# Altium project nRF2460.PrjPCB
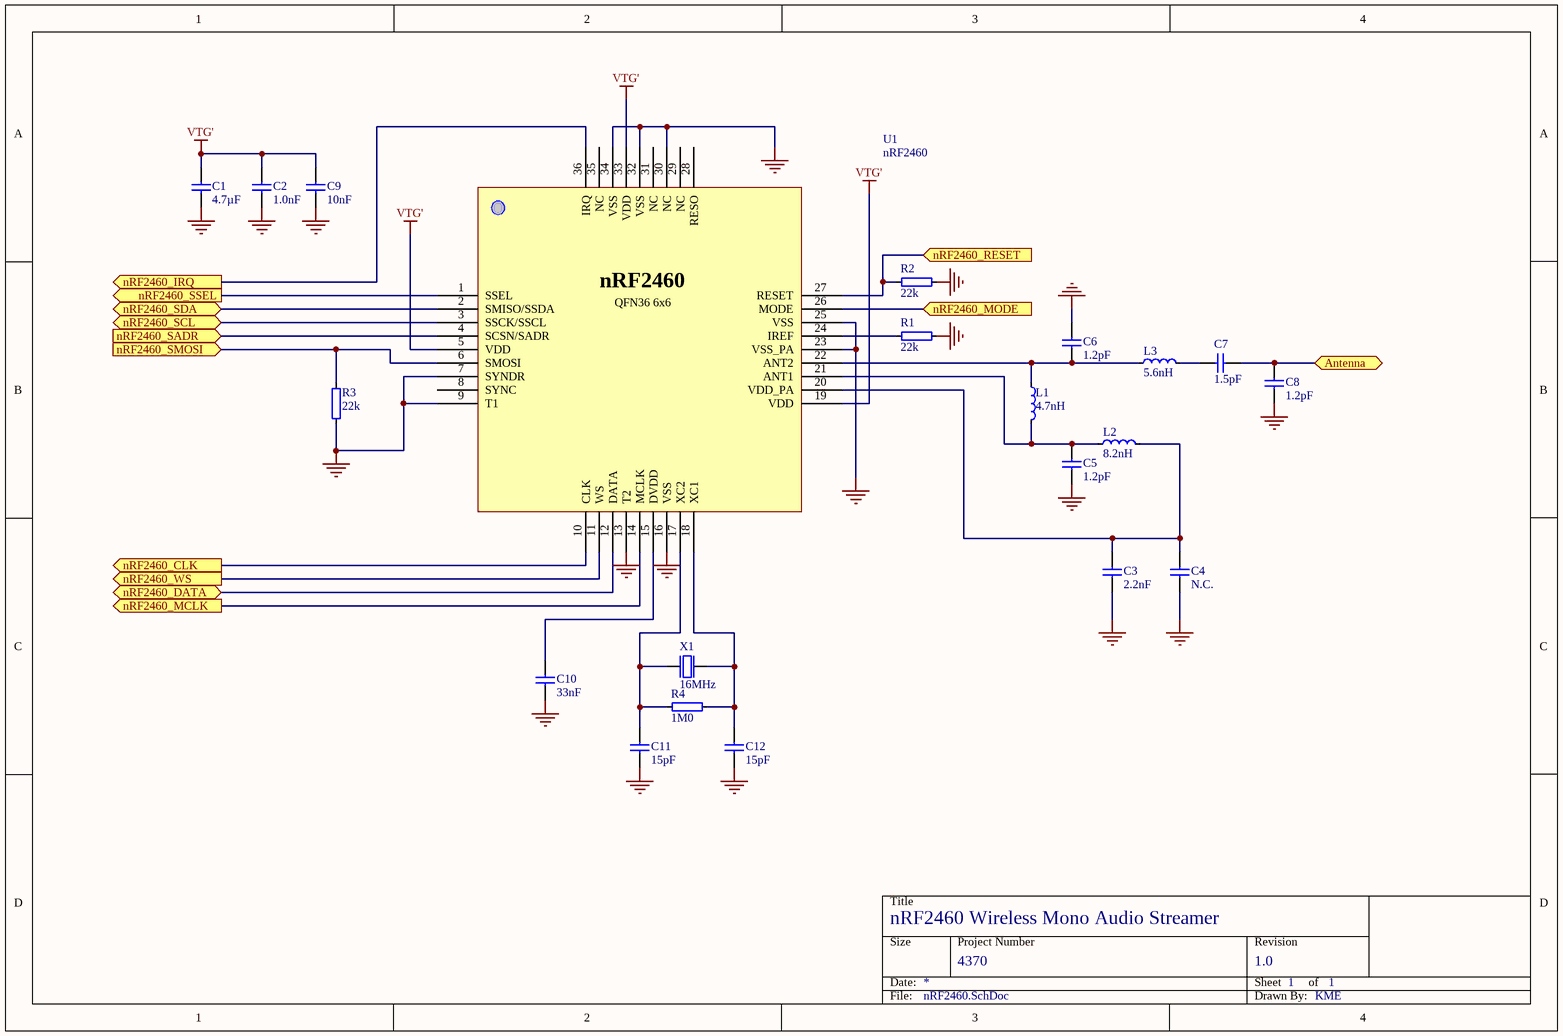
[diagram p0: nRF2460.SchDoc]
1 sheet, 21 parts. Net scope: flat (ports and power ports of the same name join across sheets).
Board file: nRF2460.PcbDoc

## Sheet nRF2460.SchDoc: nRF2460 Wireless Mono Audio Streamer
size A4; Revision: 1.0; SheetNumber: 1; SheetTotal: 1; DrawnBy: KME; ProjectNumber: 4370

### Parts
C1  4.7µF  [0805]
C2  1.0nF  [0402s]
C3  2.2nF  [0402s]
C4  N.C.  [0402s]  (no BOM)
C5  1.2pF  [0402s]
C6  1.2pF  [0402s]
C7  1.5pF  [0402s]
C8  1.2pF  [0402s]
C9  10nF  [0402s]
C10  33nF  [0402s]
C11  15pF  [0402s]
C12  15pF  [0402s]
L1  4.7nH  [0402s]
L2  8.2nH  [0402s]
L3  5.6nH  [0402s]
R1  22k  [0402s]
R2  22k  [0402s]
R3  22k  [0402s]
R4  1M0  [0402s]
U1  nRF2460  [Nordic_QFN36]
X1  16MHz  [BT-XTAL_3225]

### Ports
Antenna (bidir), nRF2460_CLK (out), nRF2460_DATA (bidir), nRF2460_IRQ (out), nRF2460_MCLK (out), nRF2460_MODE (in), nRF2460_RESET (in), nRF2460_SADR (in), nRF2460_SCL (bidir), nRF2460_SDA (bidir), nRF2460_SMOSI (in), nRF2460_SSEL (out), nRF2460_WS (out)

### Nets
GND: C1.2 C2.2 C3.1 C4.1 C5.1 C6.2 C8.1 C9.2 C10.1 C11.1 C12.1 R1.1 R2.2 R3.2 U1.7(SYNDR) U1.9(T1) U1.13(T2) U1.16(VSS) U1.23(VSS_PA) U1.25(VSS) U1.30(NC) U1.32(VSS) U1.34(VSS) X1.2(GND) X1.4(GND)
VTG': C1.1 C2.1 C9.1 U1.5(VDD) U1.19(VDD) U1.33(VDD)
NetC3_2: C3.2 C4.2 L2.2 U1.20(VDD_PA)
NetC5_2: C5.2 L1.2 L2.1 U1.21(ANT1)
NetC6_1: C6.1 L1.1 L3.1 U1.22(ANT2)
NetC7_1: C7.1 C8.2 ; port Antenna
NetC7_2: C7.2 L3.2
NetC10_2: C10.2 U1.15(DVDD)
NetC11_2: C11.2 R4.2 U1.17(XC2) X1.1(inp)
NetC12_2: C12.2 R4.1 U1.18(XC1) X1.3(out)
NetR1_2: R1.2 U1.24(IREF)
NetR2_1: R2.1 U1.27(RESET) ; port nRF2460_RESET
NetR3_1: R3.1 U1.6(SMOSI) ; port nRF2460_SMOSI
NetU1_1: U1.1(SSEL) ; port nRF2460_SSEL
NetU1_2: U1.2(SMISO/SSDA) ; port nRF2460_SDA
NetU1_3: U1.3(SSCK/SSCL) ; port nRF2460_SCL
NetU1_4: U1.4(SCSN/SADR) ; port nRF2460_SADR
NetU1_10: U1.10(CLK) ; port nRF2460_CLK
NetU1_11: U1.11(WS) ; port nRF2460_WS
NetU1_12: U1.12(DATA) ; port nRF2460_DATA
NetU1_14: U1.14(MCLK) ; port nRF2460_MCLK
NetU1_26: U1.26(MODE) ; port nRF2460_MODE
NetU1_36: U1.36(IRQ) ; port nRF2460_IRQ

Not connected (* = marked no-connect by the designer): U1 8(SYNC) 28(RESO) 29(NC) 31(NC) 35(NC)

### Notes on the sheet
- Title
- Size
- Date:
- Project Number
- Sheet         of
- Revision
- File:
- Drawn By:
- (in symbol nRF2460) QFN36 6x6

### Library data of the parts
C1 = C0805-4µ7: Chip Cap 0805; Note: Chip Cap 10%; Artikkelnr Noca: 20039266; Published: 2009-08-21; LatestRevisionDate: 2009-11-23; Publisher: Nordic Semiconductor; Value: 4.7µF; Part Number: C0805-4µ7; Manufacturer: *; Manufacturer Part Number: *; Datasheet: *; Pin Count: 2; Supplier: *; Supplier part number: *; 2nd source Supplier: *; 2nd source part number: *
C2 = C0402-1n0: Chip Cap 0402; Note: Chip Cap 10%; Artikkelnr Noca: 20039223; Published: 2009-05-08; LatestRevisionDate: 2009-11-23; Publisher: Nordic Semiconductor; Value: 1.0nF; Part Number: C0402-1n0; Manufacturer: *; Manufacturer Part Number: *; Datasheet: *; Pin Count: 2; Supplier: *; Supplier part number: *; 2nd source Supplier: *; 2nd source part number: *
C3 = C0402-2n2: Chip Cap 0402; Note: Chip Cap 10%; Artikkelnr Noca: 20039221; Part Number: C0402-2n2; Manufacturer: *; Manufacturer Part Number: *; Datasheet: *; LatestRevisionDate: 2009-11-23; Pin Count: 2; Publisher: Nordic Semiconductor; Published: 2009-05-08; Value: 2.2nF; Supplier: *; Supplier part number: *; 2nd source Supplier: *; 2nd source part number: *
C4 = C0402-N.C.: Chip Cap 0402; Artikkelnr Noca: N.A.; Part Number: C0402-N.C.; Manufacturer: *; Manufacturer Part Number: *; Datasheet: *; LatestRevisionDate: 2009-05-08; Pin Count: 2; Publisher: Nordic Semiconductor; Published: 2009-05-08; Value: N.C.; Note: Chip Cap; Supplier: *; Supplier part number: *; 2nd source Supplier: *; 2nd source part number: *
C5 C6 C8 = C0402-1.2p: Chip Cap 0402; Note: Chip Cap 1%; Artikkelnr Noca: N.A.; Part Number: C0402-1.2p; Manufacturer: *; Manufacturer Part Number: *; Datasheet: *; LatestRevisionDate: 2009-05-08; Pin Count: 2; Publisher: Nordic Semiconductor; Published: 2009-05-08; Value: 1.2pF; Supplier: *; Supplier part number: *; 2nd source Supplier: *; 2nd source part number: *
C7 = C0402-1.5p: Chip Cap 0402; Note: Chip Cap 1%; Artikkelnr Noca: 20029139; Part Number: C0402-1.5p; Manufacturer: *; Manufacturer Part Number: *; Datasheet: *; LatestRevisionDate: 2009-11-23; Pin Count: 2; Publisher: Nordic Semiconductor; Published: 2009-05-08; Value: 1.5pF; Supplier: *; Supplier part number: *; 2nd source Supplier: *; 2nd source part number: *
C9 = C0402-10n: Chip Cap 0402; Note: Chip Cap 10%; Artikkelnr Noca: 20039166; Published: 2009-05-08; LatestRevisionDate: 2009-11-23; Publisher: Nordic Semiconductor; Value: 10nF; Part Number: C0402-10n; Manufacturer: *; Manufacturer Part Number: *; Datasheet: *; Pin Count: 2; Supplier: *; Supplier part number: *; 2nd source Supplier: *; 2nd source part number: *
C10 = C0402-33n: Chip Cap 0402; Note: Chip Cap 10%; Artikkelnr Noca: 20039222; Published: 2009-05-08; Publisher: Nordic Semiconductor; Value: 33nF; Part Number: C0402-33n; Manufacturer: *; Manufacturer Part Number: *; Datasheet: *; LatestRevisionDate: 2009-11-23; Pin Count: 2; Supplier: *; Supplier part number: *; 2nd source Supplier: *; 2nd source part number: *
C11 C12 = C0402-15p: Chip Cap 0402; Note: Chip Cap 5%; Artikkelnr Noca: 20029141; Published: 2009-05-08; Publisher: Nordic Semiconductor; Value: 15pF; Part Number: C0402-15p; Manufacturer: *; Manufacturer Part Number: *; Datasheet: *; LatestRevisionDate: 2009-11-23; Pin Count: 2; Supplier: *; Supplier part number: *; 2nd source Supplier: *; 2nd source part number: *
L1 = L0402-4n7: Chip Ind 0402; Manufacturer: Murata; Manufacturer Part Number: LQP15MN4N7B02D; Note: LQP15MN4N7B02D 4.7nH 160mA 0402; Artikkelnr Noca: 33029164; Part Number: L0402-4n7; Datasheet: http://search.murata.co.jp/Ceramy/image/img/PDF/ENG/L0075S0084LQP15M.pdf; Footprint: 0402; LatestRevisionDate: 2009-11-23; Pin Count: 2; Publisher: Nordic Semiconductor; Published: 2009-05-08; Value: 4.7nH; Supplier: Digi-Key; Supplier part number: 490-1132-1-ND; 2nd source Supplier: *; 2nd source part number: *
L2 = L0402-8n2: Chip Ind 0402; Manufacturer: Murata; Manufacturer Part Number: LQP15MN8N2B02D; Note: LQP15MN8N2B02D 8.2nH 110mA 0402; Artikkelnr Noca: 33029139; Part Number: L0402-8n2; Datasheet: http://search.murata.co.jp/Ceramy/image/img/PDF/ENG/L0075S0084LQP15M.pdf; Footprint: 0402; LatestRevisionDate: 2009-11-23; Pin Count: 2; Publisher: Nordic Semiconductor; Published: 2009-05-08; Value: 8.2nH; Supplier: Digi-Key; Supplier part number: 490-1135-1-ND; 2nd source Supplier: *; 2nd source part number: *
L3 = L0402-5n6: Chip Ind 0402; Manufacturer: Murata; Manufacturer Part Number: LQP15MN5N6B02D; Note: LQP15MN5N6B02D 5.6nH 140mA 0402; Artikkelnr Noca: 33029161; Part Number: L0402-5n6; Datasheet: http://search.murata.co.jp/Ceramy/image/img/PDF/ENG/L0075S0084LQP15M.pdf; Footprint: 0402; LatestRevisionDate: 2009-11-23; Pin Count: 2; Publisher: Nordic Semiconductor; Published: 2009-05-08; Value: 5.6nH; Supplier: Digi-Key; Supplier part number: 490-1133-1-ND; 2nd source Supplier: *; 2nd source part number: *
R1-R3 = R0402-22k: Chip Res 0402; Note: Chip Res 1%; Artikkelnr Noca: 27049105; Published: 2009-05-08; Publisher: Nordic Semiconductor; Value: 22k; Part Number: R0402-22k; Manufacturer: *; Manufacturer Part Number: *; Datasheet: *; Footprint: 0402; LatestRevisionDate: 2009-11-23; Pin Count: 2; Supplier: *; Supplier part number: *; 2nd source Supplier: *; 2nd source part number: *
R4 = R0402-1M0: Chip Res 0402; Note: Chip Res 1%; Artikkelnr Noca: 27049145; Published: 2009-05-08; Publisher: Nordic Semiconductor; Value: 1M0; LatestRevisionDate: 2009-11-23; Part Number: R0402-1M0; Manufacturer: *; Manufacturer Part Number: *; Datasheet: *; Footprint: 0402; Pin Count: 2; Supplier: *; Supplier part number: *; 2nd source Supplier: *; 2nd source part number: *
U1 = nRF2460: 2.4GHz Single Chip Wireless Audio Streamer; Manufacturer: Nordic Semiconductor; Note: nRF2460 QFN36; Artikkelnr Noca: N.A.; Part Number: nRF2460; Manufacturer Part Number: nRF2460; Datasheet: *; Footprint: QFN-36; LatestRevisionDate: 2011-03-01; Pin Count: 36; Publisher: Nordic Semiconductor; Published: 2011-03-01; Value: nRF2460; Supplier: Nordic; Supplier part number: *; 2nd source Supplier: *; 2nd source part number: *
X1 = XTAL SMD 16MHz (3225): XTAL SMD 16MHz, 9pF, Mercury; Note: XTAL SMD 16MHz 3225; Artikkelnr Noca: 22019087; Part Number: XTAL SMD 16MHz (3225); Manufacturer: *; Manufacturer Part Number: *; Datasheet: http://ndap3-net.ebz.epson.co.jp/w/www/PDFS/epdoc_qd.nsf/85a4e2c523a1f89349257068002f9e30/31e98956c8f991cd4925707c003b38b1/$FILE/FA-238_238V_TSX-3225_E08X.pdf; LatestRevisionDate: 2010-02-24; Pin Count: 4; Publisher: Nordic Semiconductor; Published: 2009-05-30; Value: 16MHz; Supplier: *; Supplier part number: *; 2nd source Supplier: *; 2nd source part number: *